# EAGLE design porcupine4v1_10 (EAGLE 6.5.0)
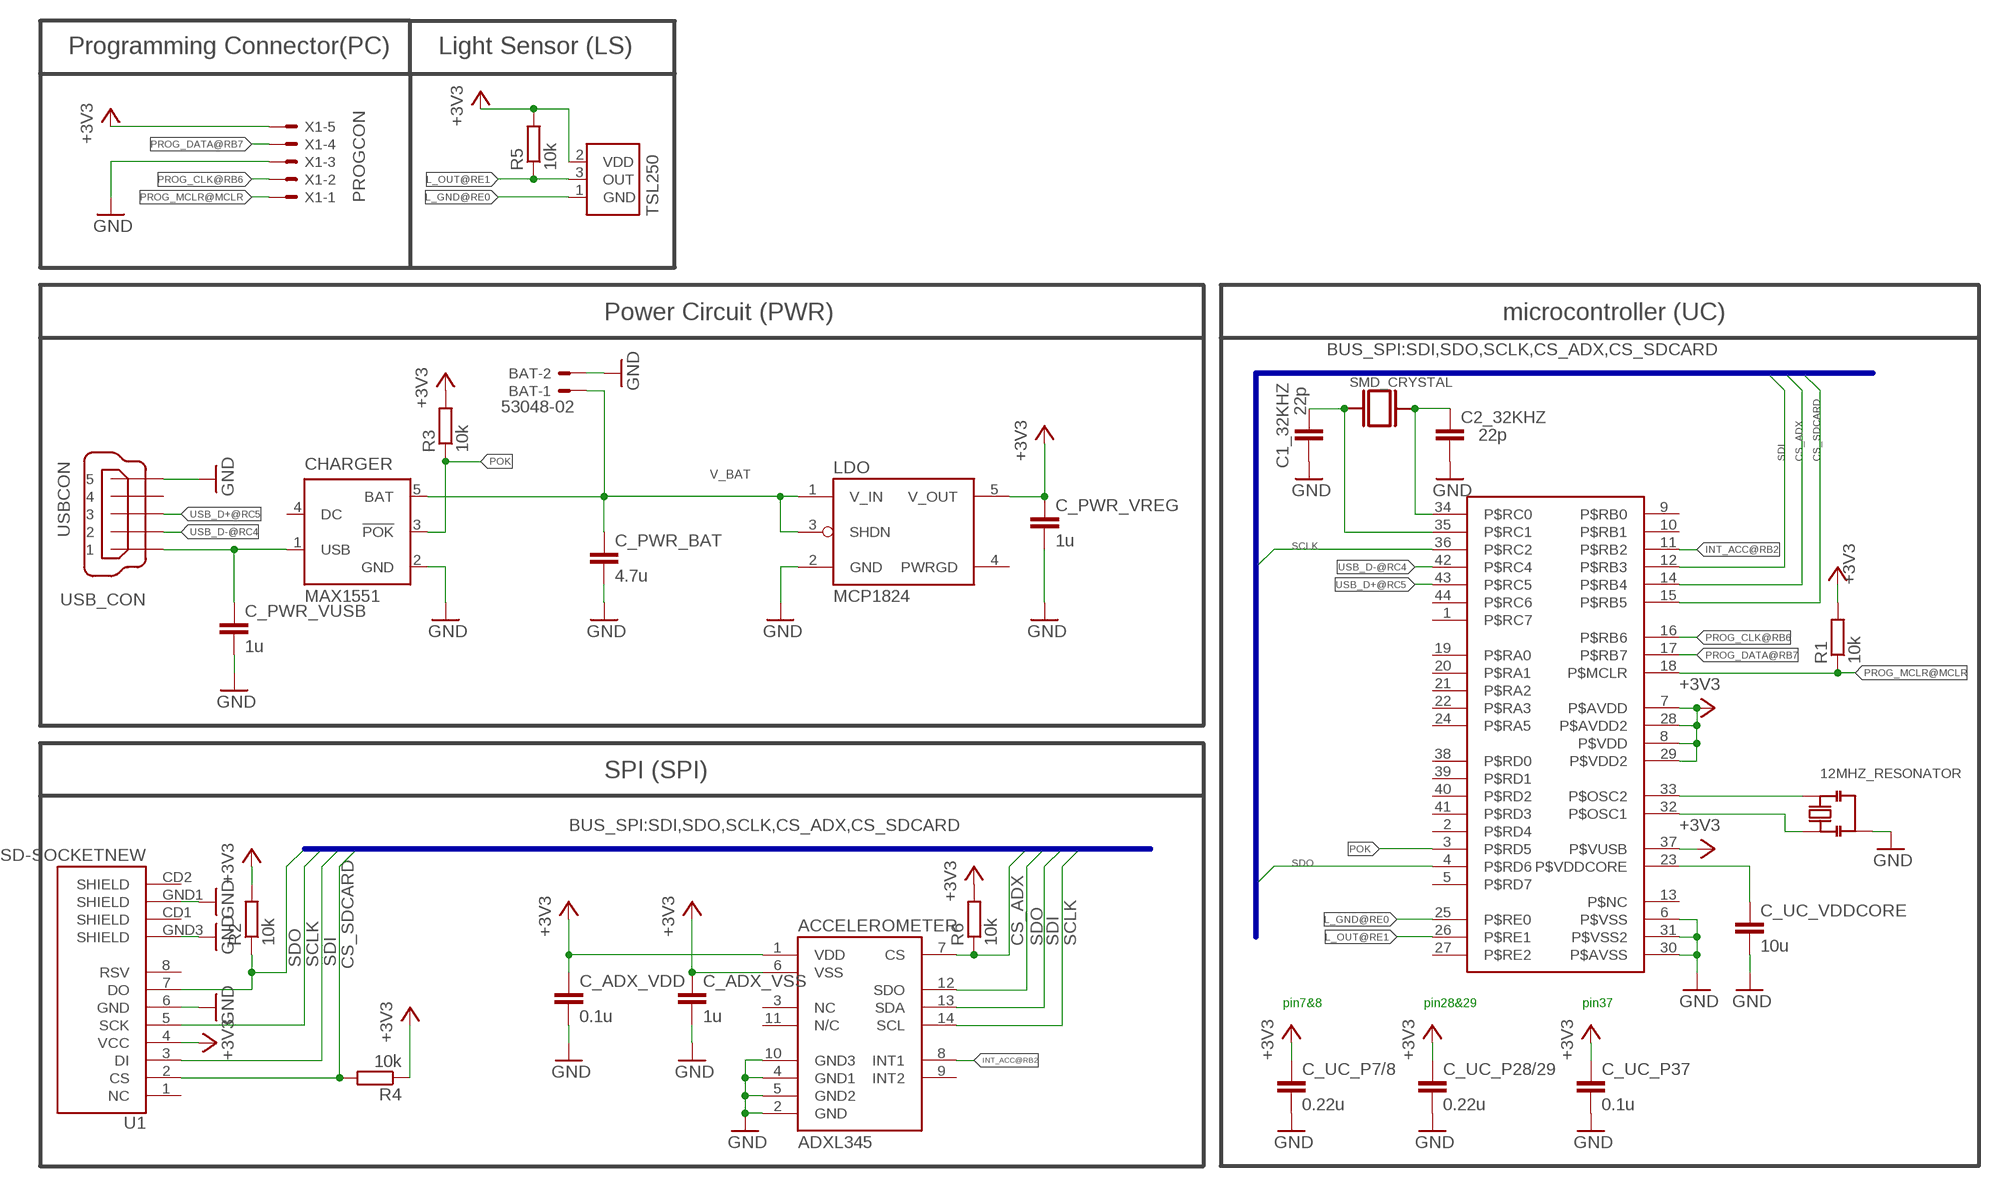
[diagram p0: schematic, sheet 1]

## Parts
12MHZ_RESONATOR  RESONATORPRQC-C  [PRQC-C]
32KHZ_CRYSTAL  SMD_CRYSTAL  [SMD_CRYSTAL]
ACCELEROMETER  ADXL345  [LGA14]
BAT  53048-02  [53048-02]
C1_32KHZ  22p  C-EUC0603K  [C0603K]
C2_32KHZ  22p  C-EUC0603K  [C0603K]
C_ADX_VDD  0.1u  C-EUC0603K  [C0603K]
C_ADX_VSS  1u  C-EUC0603K  [C0603K]
C_PWR_BAT  4.7u  C-EUC0603K  [C0603K]
C_PWR_VREG  1u  C-EUC0603K  [C0603K]
C_PWR_VUSB  1u  C-EUC0603K  [C0603K]
C_UC_P7/8  0.22u  C-EUC0603K  [C0603K]
C_UC_P28/29  0.22u  C-EUC0603K  [C0603K]
C_UC_P37  0.1u  C-EUC0603K  [C0603K]
C_UC_VDDCORE  10u  C-EUC0805K  [C0805K]
CHARGER  MAX1551  [SOT23-5L]
LDO  MCP1824  [SOT-23-5]
LIGHTSENSE  TSL250  [TSL]
PIC_CONTROLLER  PIC_P2V6  [QFN44ML8X8]
R1  10k  R-EU_R0603  [R0603]
R2  10k  R-EU_R0603  [R0603]
R3  10k  R-EU_R0603  [R0603]
R4  10k  R-EU_R0603  [R0603]
R5  10k  R-EU_R0603  [R0603]
R6  10k  R-EU_R0603  [R0603]
U1  USD-SOCKETNEW  [MICRO-SD-SOCKET-PP]
USB_CON  USBCON  [248601]
X1  PROGCON  [53047-05-OCT]

## Nets
+3V3: ACCELEROMETER.1(VDD) ACCELEROMETER.6(VSS) C_ADX_VDD.1 C_ADX_VSS.1 C_PWR_VREG.1 C_UC_P7/8.1 C_UC_P28/29.1 C_UC_P37.1 LDO.5(V_OUT) LIGHTSENSE.2(VDD) PIC_CONTROLLER.7(P$AVDD) PIC_CONTROLLER.8(P$VDD) PIC_CONTROLLER.28(P$AVDD2) PIC_CONTROLLER.29(P$VDD2) PIC_CONTROLLER.37(P$VUSB) R1.2 R2.2 R3.2 R4.1 R5.2 R6.2 U1.4(VCC) X1.5
CS_ADX: ACCELEROMETER.7(CS) PIC_CONTROLLER.14(P$RB4) R6.1
CS_SDCARD: PIC_CONTROLLER.15(P$RB5) R4.2 U1.2(CS)
GND: 12MHZ_RESONATOR.2_GND(GND) ACCELEROMETER.2(GND) ACCELEROMETER.4(GND1) ACCELEROMETER.5(GND2) ACCELEROMETER.10(GND3) BAT.2 C1_32KHZ.2 C2_32KHZ.2 C_ADX_VDD.2 C_ADX_VSS.2 C_PWR_BAT.2 C_PWR_VREG.2 C_PWR_VUSB.2 C_UC_P7/8.2 C_UC_P28/29.2 C_UC_P37.2 C_UC_VDDCORE.2 CHARGER.2(GND) LDO.2(GND) PIC_CONTROLLER.6(P$VSS) PIC_CONTROLLER.30(P$AVSS) PIC_CONTROLLER.31(P$VSS2) U1.6(GND) U1.GND1(SHIELD) U1.GND3(SHIELD) USB_CON.5 X1.3
INT_ACC@RB2: ACCELEROMETER.8(INT1) PIC_CONTROLLER.11(P$RB2)
L_GND@RE0: LIGHTSENSE.1(GND) PIC_CONTROLLER.25(P$RE0)
L_OUT@RE1: LIGHTSENSE.3(OUT) PIC_CONTROLLER.26(P$RE1) R5.1
N$1: 12MHZ_RESONATOR.3 PIC_CONTROLLER.32(P$OSC1)
N$2: 12MHZ_RESONATOR.1 PIC_CONTROLLER.33(P$OSC2)
N$3: 32KHZ_CRYSTAL.P$2 C2_32KHZ.1 PIC_CONTROLLER.34(P$RC0)
N$6: 32KHZ_CRYSTAL.P$1 C1_32KHZ.1 PIC_CONTROLLER.35(P$RC1)
POK: CHARGER.3(!POK) PIC_CONTROLLER.3(P$RD5) R3.1
PROG_CLK@RB6: PIC_CONTROLLER.16(P$RB6) X1.2
PROG_DATA@RB7: PIC_CONTROLLER.17(P$RB7) X1.4
PROG_MCLR@MCLR: PIC_CONTROLLER.18(P$MCLR) R1.1 X1.1
SCLK: ACCELEROMETER.14(SCL) PIC_CONTROLLER.36(P$RC2) U1.5(SCK)
SDI: ACCELEROMETER.13(SDA) PIC_CONTROLLER.12(P$RB3) U1.3(DI)
SDO: ACCELEROMETER.12(SDO) PIC_CONTROLLER.4(P$RD6) R2.1 U1.7(DO)
USB_D+@RC5: PIC_CONTROLLER.43(P$RC5) USB_CON.3
USB_D-@RC4: PIC_CONTROLLER.42(P$RC4) USB_CON.2
V_BAT: BAT.1 C_PWR_BAT.1 CHARGER.5(BAT) LDO.1(V_IN) LDO.3(SHDN)
V_USB: C_PWR_VUSB.1 CHARGER.1(USB) USB_CON.1
VDDCORE: C_UC_VDDCORE.1 PIC_CONTROLLER.23(P$VDDCORE)
Unconnected: ACCELEROMETER.3(NC) ACCELEROMETER.9(INT2) ACCELEROMETER.11(N/C) CHARGER.4(DC) LDO.4(PWRGD) PIC_CONTROLLER.1(P$RC7) PIC_CONTROLLER.2(P$RD4) PIC_CONTROLLER.9(P$RB0) PIC_CONTROLLER.10(P$RB1) PIC_CONTROLLER.13(P$NC) PIC_CONTROLLER.19(P$RA0) PIC_CONTROLLER.20(P$RA1) PIC_CONTROLLER.21(P$RA2) PIC_CONTROLLER.22(P$RA3) PIC_CONTROLLER.24(P$RA5) PIC_CONTROLLER.27(P$RE2) PIC_CONTROLLER.38(P$RD0) PIC_CONTROLLER.39(P$RD1) PIC_CONTROLLER.40(P$RD2) PIC_CONTROLLER.41(P$RD3) PIC_CONTROLLER.44(P$RC6) U1.1(NC) U1.8(RSV) U1.CD1(SHIELD) U1.CD2(SHIELD) USB_CON.4

## Buses
BUS_SPI:SDI,SDO,SCLK,CS_ADX,CS_SDCARD

## Notes on the sheet
- Programming Connector(PC) | Light Sensor (LS)
- Power Circuit (PWR) | microcontroller (UC)
- SPI (SPI)
- pin7&8 | pin28&29 | pin37

## Power pins joined to a net without a drawn wire
P$RD7: PIC_CONTROLLER.5(P$RD7)

## Library data of the parts
12MHZ_RESONATOR = HedgehogLib:RESONATOR; OC_DIGIKEY: 478-6318-1-ND
32KHZ_CRYSTAL = HedgehogLib:SMD_CRYSTAL; OC_FARNELL: 2101349
ACCELEROMETER = HedgehogLib:ADXL345; OC_FARNELL: 1853935
BAT = con-molex:53?-02: CONNECTOR wire to board 1.25 mm (.049 inch) pitch header; MF: MOLEX; MPN: 53048-0210; OC_FARNELL: 1012259; OC_NEWARK: 57H4718
C1_32KHZ C2_32KHZ C_ADX_VDD C_ADX_VSS C_PWR_BAT C_PWR_VREG C_PWR_VUSB C_UC_P7/8 C_UC_P28/29 C_UC_P37 C_UC_VDDCORE = rcl:C-EU: CAPACITOR, European symbol
CHARGER = maxim:MAX1551: Dual-Input USB/AC Adapter 1-Cell Li+ Battery Chargers Source: http://www.maxim-ic.com .. MAX1551-MAX1555.pdf; MF: MAXIM; MPN: MAX1551EZK-T; OC_FARNELL: 1628221; OC_NEWARK: 88H0599
LDO = HedgehogLib:MCP1824: MCP1824T-3302E/OT http://de.farnell.com/1578387; OC_FARNELL: 1578387
LIGHTSENSE = HedgehogLib:TSL250; OC_FARNELL: 1182346
PIC_CONTROLLER = HedgehogLib:PIC_P2V6; OC_FARNELL: 1706311
R1-R6 = rcl:R-EU_: RESISTOR, European symbol
U1 = SparkFun-Connectors:USD-SOCKET: microSD Socket Push-push type uSD socket. Schematic element and footprint production proven. Spark Fun Electronics SKU : PRT-00127. tDoc lines correctly indicate media card edge positions when inserting (unlocked, locked, depressed).
USB_CON = HedgehogLib:USBCON: MINI USB 2.0 Connector TypeB; OC_FARNELL: 2112367
X1 = HedgehogLib:PROGCON: Programmer Connector wire to board 1.25 mm (.049 inch) pitch header

## Board
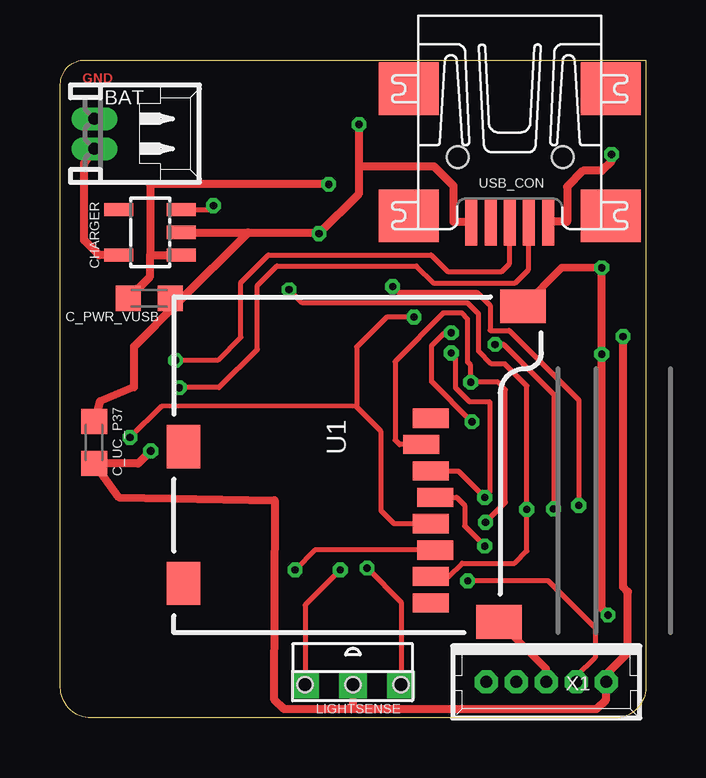
[diagram p1: board, top side]
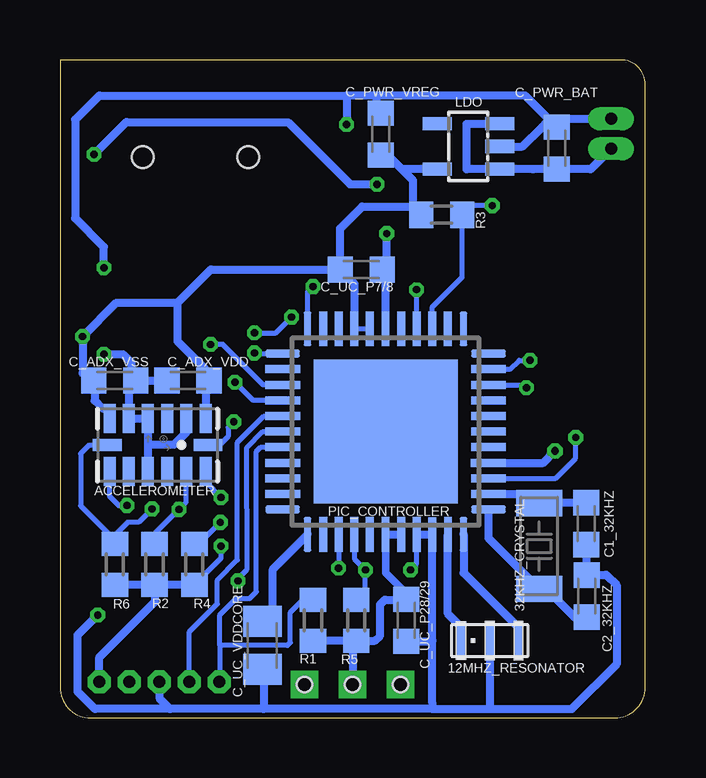
[diagram p2: board, bottom side, seen from below]

Size 24.38 x 27.43 mm. Coordinates in mm from the lower left corner, seen from the top.
Outline: 1.27,0 arc-90 0,1.27 0,26.42 arc-90 1.02,27.43 24.38,27.43 24.38,1.27 arc-90 23.11,0 1.27,0
Copper layers (1*16): Top 0.035mm / dielectric 1.5mm / Bottom 0.035mm
Design rules "default": minimum track width 6mil, minimum drill 12mil, track to track 7mil, track to pad 7mil, pad to pad 7mil, via to via 7mil, smd to smd 7mil, copper to edge 6mil, drill to drill 6mil, minimum pad ring 9mil, minimum via ring 6mil, stop-mask expansion 4mil, vias tented up to drill 0mil, thermal gap 10mil

### Footprints (pad centres in the part's own frame; a part is rotated, then mirrored left to right if it is on the bottom)
PRQC-C = smd 0.4 x 1.6: 1 -1.2,0; 2_GND 0,0; 3 1.2,0
SMD_CRYSTAL = smd 1.092 x 1.905: P$1 1.794,0; P$2 -1.778,0
LGA14 = smd 0.5 x 1.2: 1 2,1.1; 2 1.2,1.1; 3 0.4,1.1; 4 -0.4,1.1; 5 -1.2,1.1; 6 -2,1.1; 8 -2,-1.1; 9 -1.2,-1.1; 10 -0.4,-1.1; 11 0.4,-1.1; 12 1.2,-1.1; 13 2,-1.1 | smd 1.2 x 0.5: 7 -2.1,0; 14 2.1,0
53048-02 = drill 0.5 pad 0.698 long: 1 0.625,-1.25; 2 -0.625,-1.25
C0603K = smd 1.05 x 1.08: 1 -0.875,0; 2 0.875,0
C0805K = smd 1.3 x 1.6: 1 -1,0; 2 1,0
SOT23-5L = smd 0.55 x 1.2: 1 -0.95,-1.3; 2 0,-1.3; 3 0.95,-1.3; 4 0.95,1.3; 5 -0.95,1.3
SOT-23-5 = smd 0.55 x 1.2: 1 -0.95,-1.3; 2 0,-1.3; 3 0.95,-1.3; 4 0.95,1.3; 5 -0.95,1.3
TSL = drill 0.635 pad 1.15 square: 1 -1.999,0; 2 0,0; 3 1.999,0 | hole 0.635: 0,0; -2,0; 2,0
QFN44ML8X8 = smd 1.45 x 0.33: 1 -4.282,3.25; 2 -4.285,2.6; 3 -4.285,1.95; 4 -4.285,1.3; 5 -4.285,0.65; 6 -4.287,0; 7 -4.285,-0.649; 8 -4.287,-1.3; 9 -4.287,-1.949; 10 -4.285,-2.6; 11 -4.285,-3.25; 23 4.285,-3.25; 24 4.287,-2.6; 25 4.287,-1.95; 26 4.287,-1.3; 27 4.287,-0.652; 28 4.287,0; 29 4.287,0.65; 30 4.292,1.3; 31 4.293,1.953; 32 4.293,2.602; 33 4.285,3.25 | smd 0.33 x 1.45: 12 -3.25,-4.288; 13 -2.6,-4.287; 14 -1.949,-4.287; 15 -1.3,-4.287; 16 -0.65,-4.287; 17 0,-4.287; 18 0.65,-4.287; 19 1.3,-4.287; 20 1.95,-4.287; 21 2.6,-4.287; 22 3.25,-4.285; 34 3.25,4.288; 35 2.6,4.287; 36 1.95,4.287; 37 1.3,4.285; 38 0.65,4.287; 39 0,4.287; 40 -0.649,4.287; 41 -1.3,4.287; 42 -1.949,4.287; 43 -2.6,4.287; 44 -3.25,4.288 | smd 6 x 6: EXP 0,0
R0603 = smd 1 x 1.1: 1 -0.85,0; 2 0.85,0
MICRO-SD-SOCKET-PP = smd 0.8 x 1.5: 1 -8.94,10.7; 2 -7.84,10.3; 3 -6.74,10.7; 4 -5.64,10.9; 5 -4.54,10.7; 6 -3.44,10.9; 7 -2.34,10.7; 8 -1.24,10.7 | smd 1.8 x 1.4: CD1 -2.05,0.4; CD2 -7.75,0.4 | smd 1.4 x 1.9: GND1 -13.6,14.55; GND3 -0.45,13.55
248601 = smd 2 x 0.5: 1 2.25,1.6; 2 2.25,0.8; 3 2.25,0; 4 2.25,-0.8; 5 2.25,-1.6 | smd 2.2 x 2.5: M1 -3.3,-4.2; M2 -3.3,4.2; M3 2,4.2; M4 2,-4.2 | hole 0.9: -0.449,-2.177; -0.447,2.21
53047-05-OCT = drill 0.5 pad 0.889 octagon: 1 2.5,0; 2 1.25,0; 3 0,0; 4 -1.25,0; 5 -2.5,0

### Placement (x,y rotation side)
12MHZ_RESONATOR  6.48,3.23 180 bottom
32KHZ_CRYSTAL  4.42,7.16 90 bottom
ACCELEROMETER  20.32,11.38 0 bottom
BAT  2.67,24.36 270 top
C1_32KHZ  2.46,8.1 270 bottom
C2_32KHZ  2.44,5.08 90 bottom
C_ADX_VDD  19.05,14.07 180 bottom
C_ADX_VSS  22.1,14.07 0 bottom
C_PWR_BAT  3.68,23.75 90 bottom
C_PWR_VREG  11.02,24.33 90 bottom
C_PWR_VUSB  3.7,17.5 0 top
C_UC_P7/8  11.84,18.69 0 bottom
C_UC_P28/29  9.96,4.06 270 bottom
C_UC_P37  1.4,11.48 90 top
C_UC_VDDCORE  15.95,3.02 270 bottom
CHARGER  3.73,20.24 90 top
LDO  7.37,23.83 90 bottom
LIGHTSENSE  12.19,1.4 180 top
PIC_CONTROLLER  10.82,11.94 270 bottom
R1  13.84,4.06 270 bottom
R2  20.45,6.4 270 bottom
R3  8.48,20.98 180 bottom
R4  18.79,6.4 90 bottom
R5  12.04,4.06 270 bottom
R6  22.1,6.4 270 bottom
U1  4.72,3.56 270 top
USB_CON  18.72,22.93 270 top
X1  20.24,1.5 180 top

### Tracks (layer width: path | path; a pad name or v marks a point on that pad's centre or on a via)
+3V3  (via drill 0.3, 0.33)
  Top 0.203: U1.4 16.51,9.2 16.84,8.87 16.84,8 v17.68,7.16
  Top 0.33: 12.19,0.37 LIGHTSENSE.2 | 12.19,0.37 22.34,0.37 22.73,0.76 22.73,1.81 X1.5 22.76,1.83 23.65,2.72 23.65,5.26 23.44,5.46 v23.44,15.9 | 12.19,0.37 9.31,0.37 8.9,0.78 8.92,9.07 2.43,9.2 C_UC_P37.1 3.24,10.61 v3.76,11.12
  Bottom 0.203: C_ADX_VDD.1 18.32,13.84 | PIC_CONTROLLER.7 PIC_CONTROLLER.8 | 23.19,13.93 C_ADX_VSS.1 23.1,14.03 23.44,14.38 | 18.34,13.85 C_ADX_VDD.1 | 18.33,13.84 C_ADX_VDD.1 | 18.29,12.7 18.32,12.17 ACCELEROMETER.1 | v17.68,7.16 17.68,6.66 R4.1
  Bottom 0.305: 9.96,5.19 10.82,6.05 PIC_CONTROLLER.28
  Bottom 0.33: ACCELEROMETER.6 22.32,12.91 22.61,12.91 22.94,13.23 22.94,13.81 C_ADX_VSS.1 | 18.32,13.84 ACCELEROMETER.1 | v23.44,15.9 23.44,14.38 | R2.2 R6.2 | X1.5 22.74,2.53 20.42,4.85 R2.2 | 23.42,15.93 v23.44,15.9 | R4.1 R2.2 | v23.44,15.9 22.04,17.31 19.48,17.31 | C_UC_P7/8.1 18.1,18.69 19.48,17.31 | C_UC_P7/8.1 12.71,20.41 11.79,21.33 9.68,21.33 | C_ADX_VDD.1 18.33,14.54 19.48,15.7 19.48,17.31 | 12.19,3.21 R5.2 11.26,3.21 11.05,3.43 11.05,4.72 10.85,4.93 9.94,4.93 C_UC_P28/29.1 | 12.19,3.21 LIGHTSENSE.2 | 12.19,3.21 R1.2 | PIC_CONTROLLER.28 PIC_CONTROLLER.29 | R3.2 9.68,21.33 | C_UC_P7/8.1 12.12,18.1 PIC_CONTROLLER.8 | C_UC_P28/29.1 9.96,5.19 | 10.03,5.03 C_UC_P28/29.1 | PIC_CONTROLLER.37 4.25,10.64 v3.76,11.12 | 9.68,21.33 9.68,22.42 10.06,22.8 | LDO.5 10.06,22.88 10.06,22.8 | 10.06,22.8 10.72,23.46 C_PWR_VREG.1
CS_ADX  (via drill 0.3)
  Top 0.203: v20.55,8.71 20.55,13.49 18.47,15.57 v18.11,15.57
  Bottom 0.203: ACCELEROMETER.7 23.16,11.38 23.52,11.02 23.52,8.84 22.25,7.57 | v20.55,8.71 21.11,8.15 21.57,8.15 22.12,7.59 22.25,7.57 | R6.1 22.25,7.57 | PIC_CONTROLLER.14 15.92,13.89 17.6,15.57 v18.11,15.57
CS_SDCARD  (via drill 0.3)
  Top 0.203: v17.7,8.15 18.54,8.99 18.54,13.69 18.24,13.99 v17.09,13.99 17.09,14.71 16.97,14.83 16.97,16.64 16.71,16.89 15.98,16.89 13.95,14.86 13.95,11.58 14.13,11.4 U1.2
  Bottom 0.203: R4.2 18.35,7.5 v17.7,8.15 | PIC_CONTROLLER.15 16.34,13.24 v17.09,13.99
GND  (via drill 0.3, 0.3 pad 0.3)
  Top 0.203: U1.6 10.6,7 v9.78,6.17
  Top 0.305: U1.GND1 20.89,18.77 v22.55,18.77 | U1.GND3 20.24,2.04 X1.3
  Top 0.33: 17.14,20.58 USB_CON.5 16.38,20.68 16.38,22.17 15.57,22.99 12.45,22.99 | v22.55,18.77 v22.55,15.16 22.55,4.57 22.81,4.32 v22.81,4.29 | 12.45,22.99 12.45,21.87 v10.77,20.19 10.72,20.24 7.82,20.24 | 12.45,22.99 v12.45,24.74 | 1.66,12.53 C_UC_P37.2 1.64,13.19 3.07,13.79 3.07,15.49 4.92,17.34 | 4.92,17.34 7.82,20.24 | CHARGER.2 7.82,20.24 | C_PWR_VUSB.2 4.74,17.34 4.92,17.34
  Bottom 0.203: 21.52,13.82 21.44,13.82 C_ADX_VSS.2 | v9.78,6.17 9.52,6.43 PIC_CONTROLLER.30
  Bottom 0.33: 21.52,13.82 ACCELEROMETER.5 ACCELEROMETER.4 20.72,11.39 | 20.72,11.39 ACCELEROMETER.10 | ACCELEROMETER.2 19.12,11.91 19.63,11.39 20.72,11.39 | C_ADX_VDD.2 C_ADX_VSS.2 21.41,13.9 21.41,14.81 21.77,15.16 v22.55,15.16 | v22.55,18.77 22.55,19.63 23.75,20.83 23.75,24.94 22.75,25.95 12.45,25.95 | 19.81,0.38 22.93,0.38 23.65,1.09 23.65,3.45 v22.81,4.29 | 8.87,0.38 15.9,0.38 | 15.9,0.38 19.81,0.38 | 19.81,0.38 20.22,0.79 X1.3 | PIC_CONTROLLER.6 10.82,18.56 C_UC_P7/8.2 10.77,18.88 v10.77,20.19 | 8.87,3.23 8.87,0.61 8.87,0.38 | 8.87,3.23 PIC_CONTROLLER.31 PIC_CONTROLLER.30 | 12.45,25.95 v12.45,24.74 | C_UC_P28/29.2 8.91,3.18 8.87,3.23 | 8.87,0.38 7.75,0.38 6.53,0.38 | C1_32KHZ.2 2.44,6.99 C2_32KHZ.2 2.42,5.97 1.63,5.97 1.19,5.54 1.19,2.23 3.05,0.38 6.53,0.38 | 12MHZ_RESONATOR.2_GND 6.48,0.43 6.53,0.38 | 11.18,25.95 5,25.95 C_PWR_BAT.2 | 11.18,25.95 12.45,25.95 | C_PWR_VREG.2 11.18,25.34 11.18,25.95 | C_PWR_BAT.2 3.37,24.98 BAT.2 | LDO.2 5.12,23.82 4.29,24.64 4.08,24.87 C_PWR_BAT.2 | C_UC_VDDCORE.2 15.9,1.97 15.9,0.38
INT_ACC@RB2  (via drill 0.3)
  Top 0.203: v21.6,8.86 21.6,13.25 18.69,16.15 17.91,16.15 17.91,17.2 17.37,17.73 14.1,17.73 v13.84,17.98
  Bottom 0.203: ACCELEROMETER.8 22.32,9.24 21.94,8.86 v21.6,8.86 | PIC_CONTROLLER.11 14.07,17.76 v13.84,17.98
L_GND@RE0  (via drill 0.3)
  Top 0.203: v12.78,6.25 14.19,4.83 LIGHTSENSE.1
  Bottom 0.203: PIC_CONTROLLER.25 12.77,6.36 v12.78,6.25
L_OUT@RE1  (via drill 0.3)
  Top 0.203: v11.66,6.17 10.19,4.71 LIGHTSENSE.3
  Bottom 0.203: PIC_CONTROLLER.26 12.12,6.63 v11.66,6.17 11.66,5.07 R5.1
N$1
  Bottom 0.33: PIC_CONTROLLER.32 8.22,4.34 7.68,3.8 12MHZ_RESONATOR.3
N$2
  Bottom 0.33: PIC_CONTROLLER.33 7.57,6.05 5.29,3.77 12MHZ_RESONATOR.1
N$3
  Bottom 0.203: 4.95,5.41 32KHZ_CRYSTAL.P$2
  Bottom 0.33: C2_32KHZ.1 2.96,4.21 3.96,5.21 32KHZ_CRYSTAL.P$2 6.53,7.5 PIC_CONTROLLER.34
N$6
  Bottom 0.33: C1_32KHZ.1 2.61,8.96 32KHZ_CRYSTAL.P$1 4.8,9.34 PIC_CONTROLLER.35
POK  (via drill 0.3)
  Top 0.203: CHARGER.3 6.21,21.19 v6.38,21.36
  Bottom 0.203: v6.38,21.36 7.39,21.36 7.48,21.38 R3.1 7.63,18.38 8.87,17.14 PIC_CONTROLLER.3
PROG_CLK@RB6
  Bottom 0.203: PIC_CONTROLLER.16 15.88,12.59 16.99,11.48 16.99,6.58 17.83,5.74 17.83,4.75 18.99,3.59 X1.2
PROG_DATA@RB7  (via drill 0.3)
  Top 0.203: v16.97,5.71 20.32,5.71 22.28,3.76 22.28,2.52 21.49,1.73 X1.4
  Bottom 0.203: v16.97,5.71 16.97,5.82 16.59,6.2 16.61,11.25 15.93,11.94 PIC_CONTROLLER.17
PROG_MCLR@MCLR
  Bottom 0.203: PIC_CONTROLLER.18 16.02,11.29 16.2,11.1 16.2,5.26 16.48,4.98 17.04,4.98 17.72,4.3 17.72,3.02 | 17.72,3.02 14.91,3.02 14.78,3.15 14.78,4.39 14.26,4.91 R1.1 | 17.72,3.02 17.72,1.52 X1.1
SCLK  (via drill 0.3)
  Top 0.203: v2.9,11.69 4.19,12.98 12.29,13.01 12.34,12.95 | U1.5 13.9,8.1 13.36,8.64 13.36,11.94 12.34,12.95 | v17.14,12.34 15.47,14.02 15.47,15.52 16,16.05 v16.28,16.05 | v14.73,16.71 13.59,16.71 12.34,15.47 12.34,12.95
  Bottom 0.203: v17.14,12.34 17.37,12.12 17.37,11.73 17.75,11.35 18.09,11.35 18.17,11.43 ACCELEROMETER.14 | PIC_CONTROLLER.36 3.73,9.99 2.9,10.82 v2.9,11.69 | v16.28,16.05 15.39,16.05 v14.73,16.71
SDI  (via drill 0.3)
  Top 0.203: v16.28,15.21 16.46,15.04 16.46,13.77 17.04,13.18 17.88,13.18 17.88,9.4 v17.68,9.2 16.58,10.3 U1.3
  Bottom 0.203: v16.28,15.21 16.23,15.19 PIC_CONTROLLER.12 | ACCELEROMETER.13 18.32,9.84 v17.68,9.2
SDO  (via drill 0.3)
  Top 0.203: U1.7 16.18,5.9 16.74,6.45 18.92,6.45 19.43,6.96 v19.43,8.69 19.43,13.84 18.52,14.76 17.96,14.76 17.42,15.29 17.42,16.84 16.97,17.3 10.08,17.3 v9.53,17.86
  Bottom 0.203: ACCELEROMETER.12 19.15,10.31 19.15,8.97 v19.43,8.69 20.4,7.72 20.4,7.29 20.43,7.25 R2.1 | PIC_CONTROLLER.4 9.52,17.63 v9.53,17.86
USB_D+@RC5  (via drill 0.3)
  Top 0.203: USB_CON.3 18.72,20.56 18.72,18.95 18.39,18.62 16.13,18.62 15.44,19.3 8.66,19.3 7.52,18.16 7.52,15.88 6.55,14.91 v4.8,14.91
  Bottom 0.203: PIC_CONTROLLER.43 5.63,14.54 5.26,14.91 v4.8,14.91
USB_D-@RC4  (via drill 0.3)
  Top 0.203: USB_CON.2 19.51,20.54 19.51,18.69 18.95,18.14 15.54,18.14 14.83,18.85 9.02,18.85 8.2,18.03 8.2,15.37 6.6,13.77 v4.95,13.77
  Bottom 0.203: v4.95,13.77 5.07,13.89 PIC_CONTROLLER.42
V_BAT
  Top 0.33: CHARGER.5 1.61,19.29 0.99,19.91 0.99,23.13 BAT.1
  Bottom 0.33: BAT.1 2.28,22.87 C_PWR_BAT.1 4.67,22.88 LDO.1 7.44,22.88 7.44,24.77 LDO.3
V_USB  (via drill 0.3, 0.3 pad 0.3)
  Top 0.33: 20.32,20.81 USB_CON.1 21.11,20.68 21.11,22.15 21.77,22.81 22.55,22.81 22.96,23.22 v22.96,23.5 | 3.73,19.29 3.73,22.25 v11.18,22.25 | 3.73,19.29 CHARGER.1 | C_PWR_VUSB.1 3.73,18.4 3.73,19.29
  Bottom 0.33: v11.18,22.25 12.29,22.25 14.88,24.84 21.61,24.84 v22.96,23.5
VDDCORE
  Bottom 0.33: C_UC_VDDCORE.1 15.52,4.45 15.52,6.2 14.85,6.87 PIC_CONTROLLER.23

### Text on the board
Top: GND
tNames: LIGHTSENSE
bNames: 32KHZ_CRYSTAL | 12MHZ_RESONATOR